# EAGLE design v3-tb (EAGLE 9.5.0)
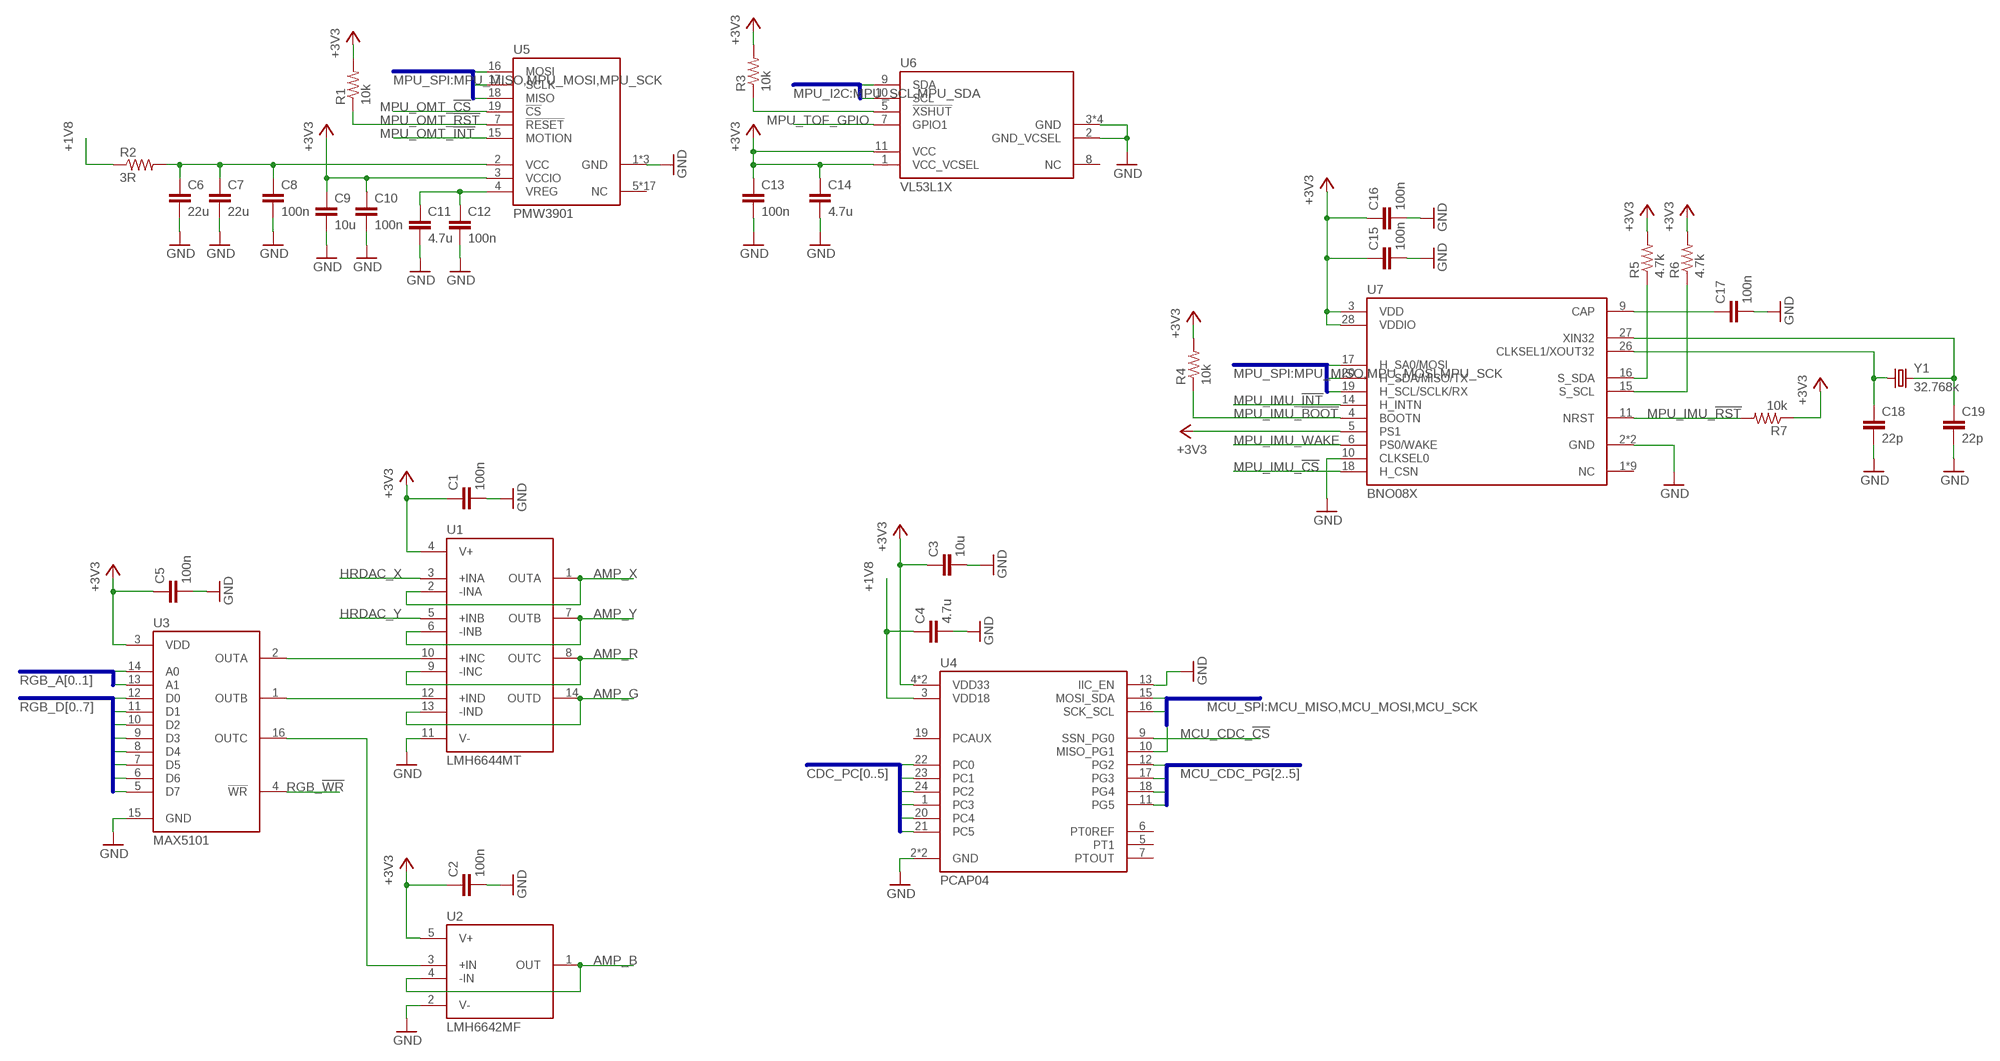
[diagram p0: schematic, sheet 1, part 1 of 2]
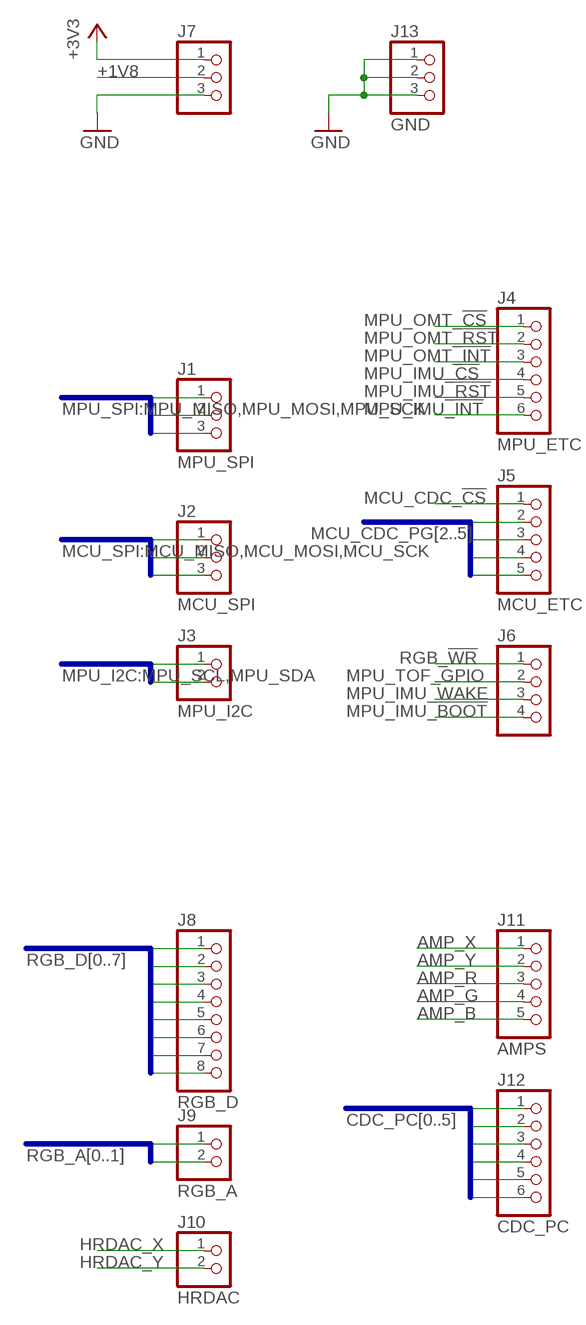
[diagram p1: schematic, sheet 1, part 2 of 2]

## Parts
C1  100n  C-EUC0603  [C0603]
C2  100n  C-EUC0603  [C0603]
C3  10u  C-EUC0603  [C0603]
C4  4.7u  C-EUC0603  [C0603]
C5  100n  C-EUC0603  [C0603]
C6  22u  C-EUC0603  [C0603]
C7  22u  C-EUC0603  [C0603]
C8  100n  C-EUC0603  [C0603]
C9  10u  C-EUC0603  [C0603]
C10  100n  C-EUC0603  [C0603]
C11  4.7u  C-EUC0603  [C0603]
C12  100n  C-EUC0603  [C0603]
C13  100n  C-EUC0603  [C0603]
C14  4.7u  C-EUC0603  [C0603]
C15  100n  C-EUC0603  [C0603]
C16  100n  C-EUC0603  [C0603]
C17  100n  C-EUC0603  [C0603]
C18  22p  C-EUC0603  [C0603]
C19  22p  C-EUC0603  [C0603]
J1  MPU_SPI  PINHD-1X3  [1X03]
J2  MCU_SPI  PINHD-1X3  [1X03]
J3  MPU_I2C  PINHD-1X2  [1X02]
J4  MPU_ETC  PINHD-1X6  [1X06]
J5  MCU_ETC  PINHD-1X5  [1X05]
J6  PINHD-1X4  [1X04]
J7  PINHD-1X3  [1X03]
J8  RGB_D  PINHD-1X8  [1X08]
J9  RGB_A  PINHD-1X2  [1X02]
J10  HRDAC  PINHD-1X2  [1X02]
J11  AMPS  PINHD-1X5  [1X05]
J12  CDC_PC  PINHD-1X6  [1X06]
J13  GND  PINHD-1X3  [1X03]
R1  10k  R-US_R0603  [R0603]
R2  3R  R-US_R0603  [R0603]
R3  10k  R-US_R0603  [R0603]
R4  10k  R-US_R0603  [R0603]
R5  4.7k  R-US_R0603  [R0603]
R6  4.7k  R-US_R0603  [R0603]
R7  10k  R-US_R0603  [R0603]
U1  LMH6644MT  [SOP65P640X120-14N]
U2  LMH6642MF  [SOT95P280X145-5N]
U3  MAX5101  [SOP65P640X110-16N]
U4  PCAP04  [QFN50P400X400X100-24N]
U5  PMW3901  [PMW3901]
U6  VL53L1X  [VL53L1X]
U7  BNO08X  [BNO08X]
Y1  32.768k  FC-12M  [FC-12M]

## Nets
+1V8 [power]: C4.1 J7.2 R2.1 U4.3(VDD18)
+3V3 [power]: C1.1 C2.1 C3.1 C5.1 C9.1 C10.1 C13.1 C14.1 C15.1 C16.1 J7.1 R1.2 R3.2 R4.2 R5.2 R6.2 R7.1 U1.4(V+) U2.5(V+) U3.3(VDD) U4.4(VDD33) U4.14(VDD33) U5.3(VCCIO) U6.1(VCC_VCSEL) U6.11(VCC) U7.3(VDD) U7.5(PS1) U7.28(VDDIO)
AMP_B: J11.5 U2.1(OUT) U2.4(-IN)
AMP_G: J11.4 U1.13(-IND) U1.14(OUTD)
AMP_R: J11.3 U1.8(OUTC) U1.9(-INC)
AMP_X: J11.1 U1.1(OUTA) U1.2(-INA)
AMP_Y: J11.2 U1.6(-INB) U1.7(OUTB)
CDC_PC0: J12.3 U4.22(PC0)
CDC_PC1: J12.4 U4.23(PC1)
CDC_PC2: J12.5 U4.24(PC2)
CDC_PC3: J12.6 U4.1(PC3)
CDC_PC4: J12.1 U4.20(PC4)
CDC_PC5: J12.2 U4.21(PC5)
GND [power]: C1.2 C2.2 C3.2 C4.2 C5.2 C6.2 C7.2 C8.2 C9.2 C10.2 C11.2 C12.2 C13.2 C14.2 C15.2 C16.2 C17.2 C18.2 C19.2 J7.3 J13.1 J13.2 J13.3 U1.11(V-) U2.2(V-) U3.15(GND) U4.2(GND) U4.8(GND) U4.13(IIC_EN) U5.1(GND) U5.21(GND) U5.29(GND) U6.2(GND_VCSEL) U6.3(GND) U6.4(GND) U6.6(GND) U6.12(GND) U7.2(GND) U7.10(CLKSEL0) U7.25(GND)
HRDAC_X: J10.1 U1.3(+INA)
HRDAC_Y: J10.2 U1.5(+INB)
MCU_CDC_!CS: J5.1 U4.9(SSN_PG0)
MCU_CDC_PG2: J5.2 U4.12(PG2)
MCU_CDC_PG3: J5.3 U4.17(PG3)
MCU_CDC_PG4: J5.4 U4.18(PG4)
MCU_CDC_PG5: J5.5 U4.11(PG5)
MCU_MISO: J2.2 U4.10(MISO_PG1)
MCU_MOSI: J2.1 U4.15(MOSI_SDA)
MCU_SCK: J2.3 U4.16(SCK_SCL)
MPU_IMU_!BOOT: J6.4 R4.1 U7.4(BOOTN)
MPU_IMU_!CS: J4.4 U7.18(H_CSN)
MPU_IMU_!INT: J4.6 U7.14(H_INTN)
MPU_IMU_!RST: J4.5 R7.2 U7.11(NRST)
MPU_IMU_WAKE: J6.3 U7.6(PS0/WAKE)
MPU_MISO: J1.2 U5.18(MISO) U7.20(H_SDA/MISO/TX)
MPU_MOSI: J1.1 U5.16(MOSI) U7.17(H_SA0/MOSI)
MPU_OMT_!CS: J4.1 U5.19(!CS)
MPU_OMT_!INT: J4.3 U5.15(MOTION)
MPU_OMT_!RST: J4.2 R1.1 U5.7(!RESET)
MPU_SCK: J1.3 U5.17(SCLK) U7.19(H_SCL/SCLK/RX)
MPU_SCL: J3.2 U6.10(SCL)
MPU_SDA: J3.1 U6.9(SDA)
MPU_TOF_GPIO: J6.2 U6.7(GPIO1)
N$1: C11.1 C12.1 U5.4(VREG)
N$2: R6.1 U7.15(S_SCL)
N$3: C6.1 C7.1 C8.1 R2.2 U5.2(VCC)
N$4: R3.1 U6.5(!XSHUT)
N$5: C19.1 U7.27(XIN32) Y1.2
N$6: U1.10(+INC) U3.2(OUTA)
N$7: U1.12(+IND) U3.1(OUTB)
N$8: U2.3(+IN) U3.16(OUTC)
N$9: R5.1 U7.16(S_SDA)
N$10: C17.1 U7.9(CAP)
N$11: C18.1 U7.26(CLKSEL1/XOUT32) Y1.1
RGB_!WR: J6.1 U3.4(!WR)
RGB_A0: J9.1 U3.14(A0)
RGB_A1: J9.2 U3.13(A1)
RGB_D0: J8.1 U3.12(D0)
RGB_D1: J8.2 U3.11(D1)
RGB_D2: J8.3 U3.10(D2)
RGB_D3: J8.4 U3.9(D3)
RGB_D4: J8.5 U3.8(D4)
RGB_D5: J8.6 U3.7(D5)
RGB_D6: J8.7 U3.6(D6)
RGB_D7: J8.8 U3.5(D7)
Unconnected: U4.5(PT1) U4.6(PT0REF) U4.7(PTOUT) U4.19(PCAUX) U5.5(NC) U5.6(NC) U5.8(NC) U5.9(NC) U5.10(NC) U5.11(NC) U5.12(NC) U5.13(NC) U5.14(NC) U5.20(NC) U5.22(NC) U5.23(NC) U5.24(NC) U5.25(NC) U5.26(NC) U5.27(NC) U5.28(NC) U6.8(NC) U7.1(NC) U7.7(NC) U7.8(NC) U7.12(NC) U7.13(NC) U7.21(NC) U7.22(NC) U7.23(NC) U7.24(NC)

## Buses
RGB_D[0..7]
RGB_A[0..1]
CDC_PC[0..5]
MCU_CDC_PG[2..5]
MCU_SPI:MCU_MISO,MCU_MOSI,MCU_SCK
MPU_SPI:MPU_MISO,MPU_MOSI,MPU_SCK
MPU_I2C:MPU_SCL,MPU_SDA

## Library data of the parts
C1-C19 = rcl:C-EU: CAPACITOR, European symbol; SPICEPREFIX: C
J1 J2 J7 J13 = pinhead:PINHD-1X3: PIN HEADER
J3 J9 J10 = pinhead:PINHD-1X2: PIN HEADER
J4 J12 = pinhead:PINHD-1X6: PIN HEADER
J5 J11 = pinhead:PINHD-1X5: PIN HEADER
J6 = pinhead:PINHD-1X4: PIN HEADER
J8 = pinhead:PINHD-1X8: PIN HEADER
R1-R7 = rcl:R-US_: RESISTOR, American symbol; SPICEPREFIX: R
U1 = v3-device-2:LMH6644
U2 = v3-device-2:LMH6642
U3 = v3-device-2:MAX5101
U4 = v3-device-2:PCAP04
U5 = v3-device-2:PMW3901
U6 = v3-device-2:VL53L1X
U7 = v3-device-2:BNO08X
Y1 = crystal:FC-12M: kHz RANGE CRYSTAL UNIT LOW PROFILE SMD Source: Epson Toyocom FC-12M.pdf

## Net classes
0 default: width 0.127 mm, drill 0.254 mm, clearance 0.127 mm
1 power: width 0.254 mm, drill 0.381 mm, clearance 0.127 mm

## Board
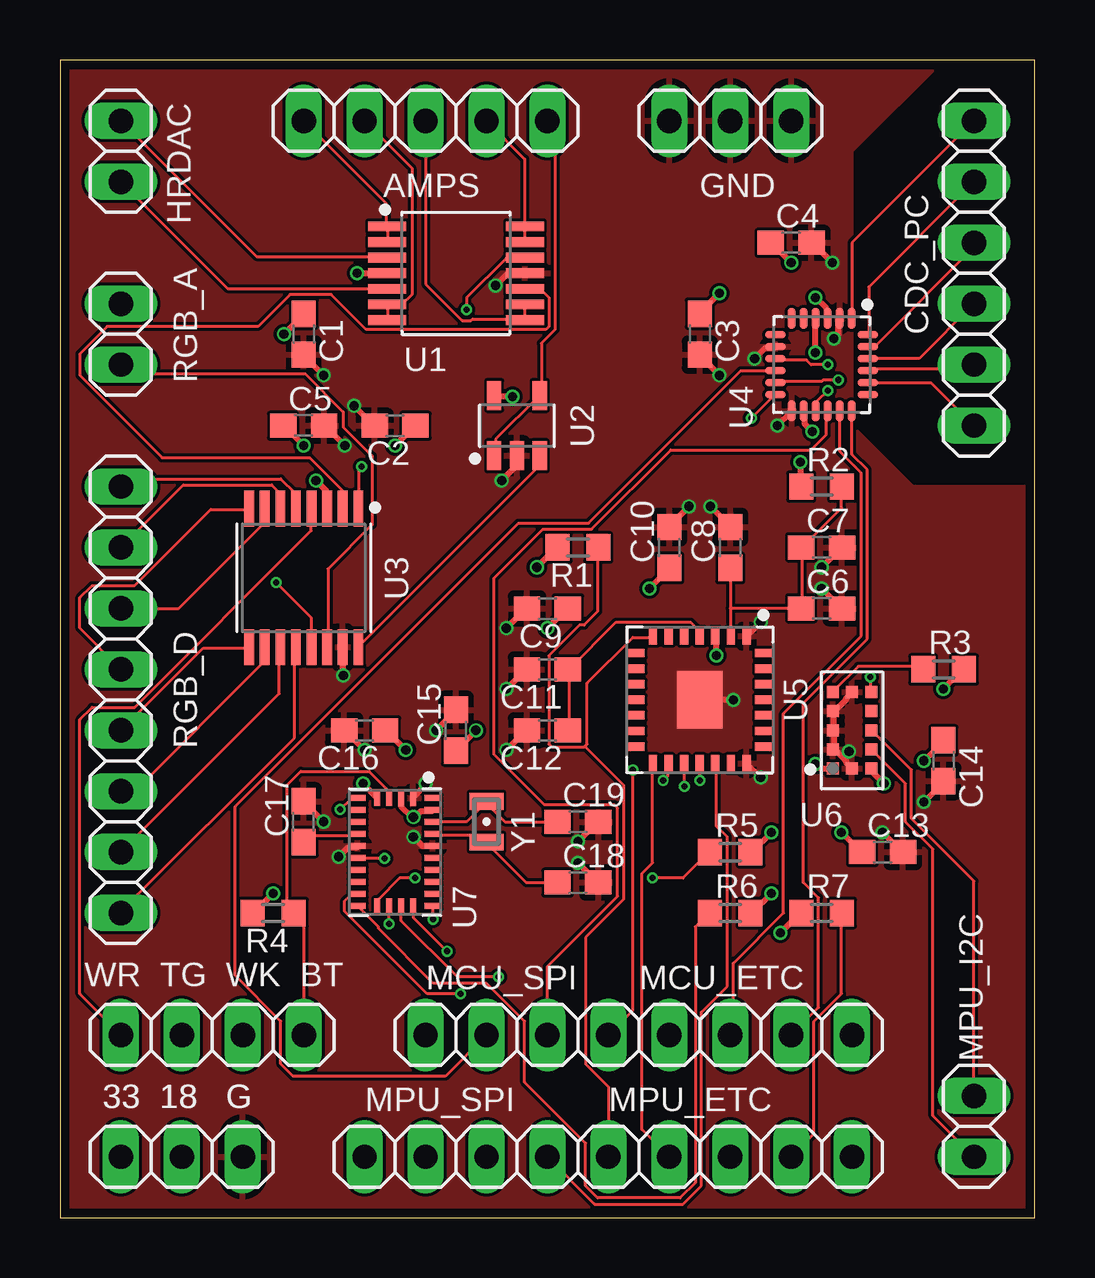
[diagram p2: board, top side]
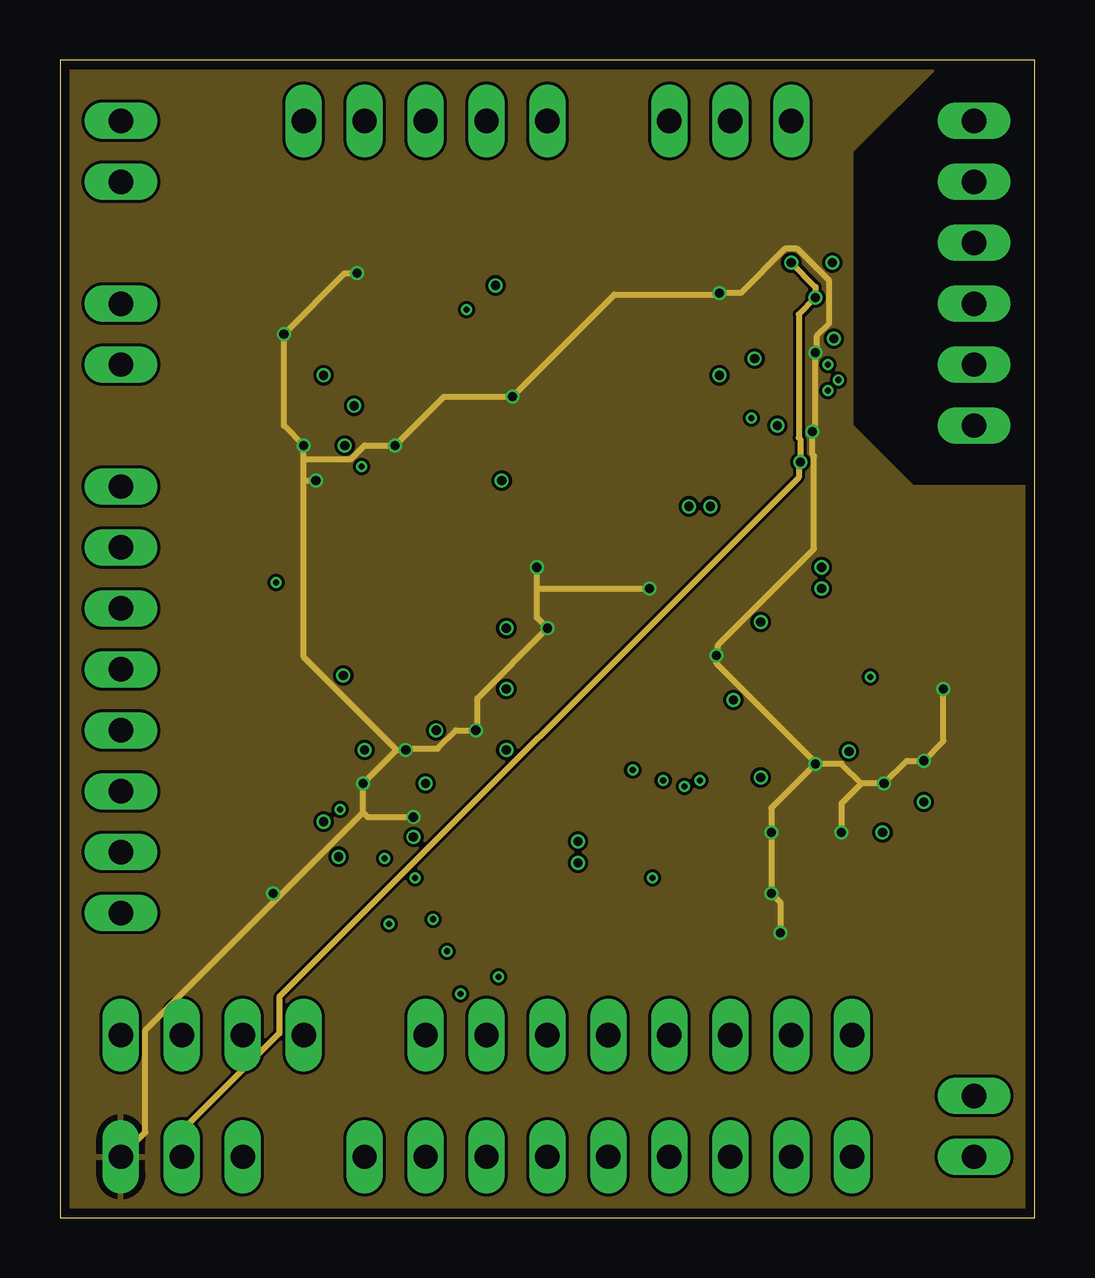
[diagram p3: board, inner layer Route2]
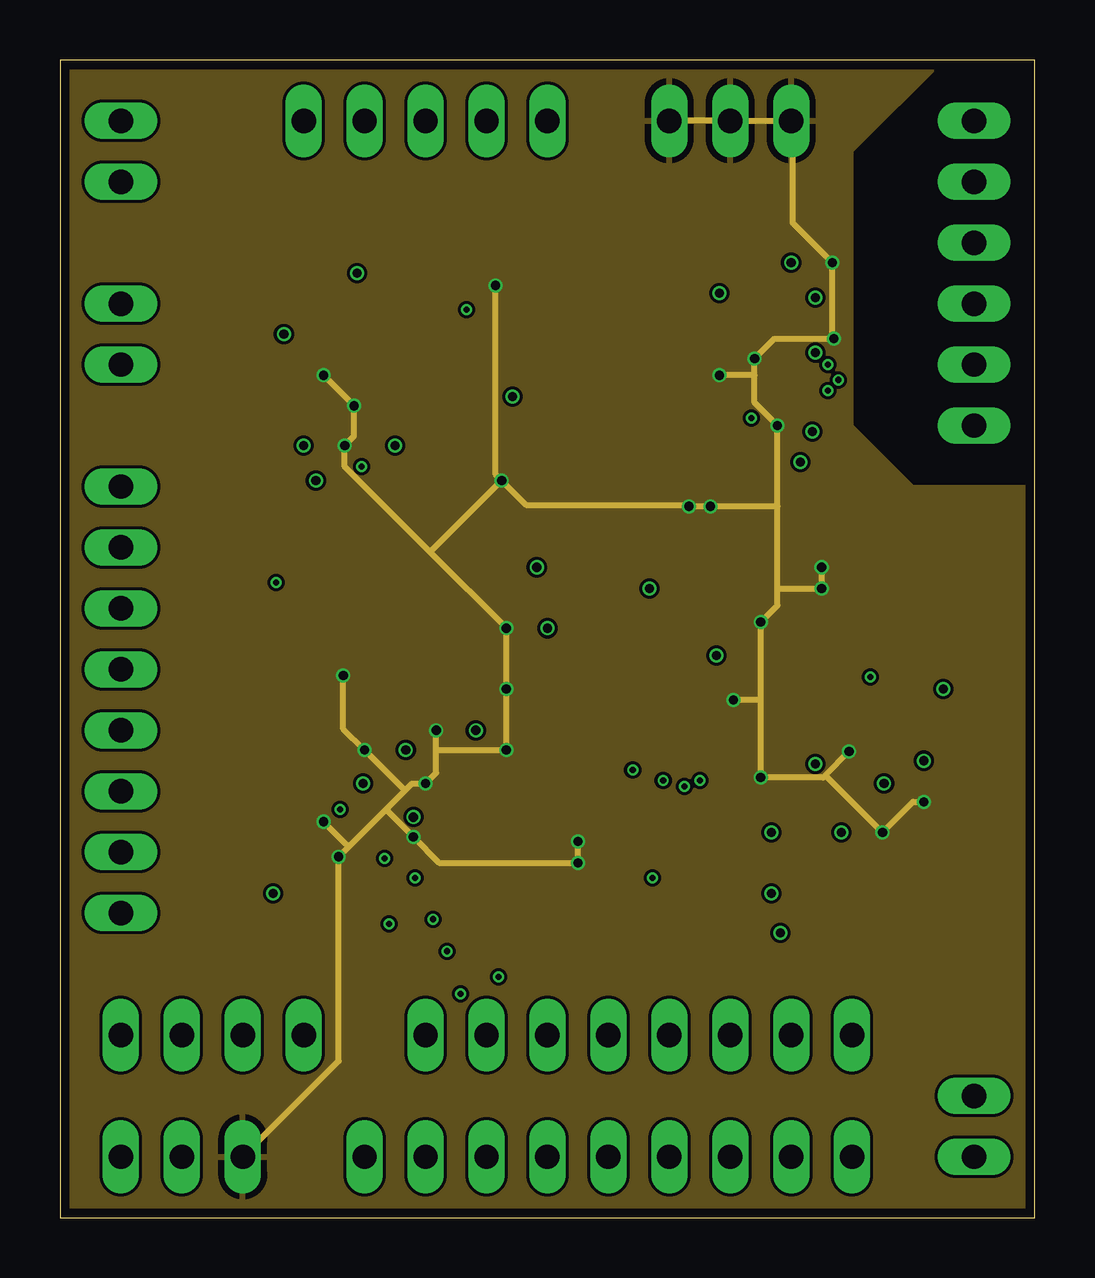
[diagram p4: board, inner layer Route15]
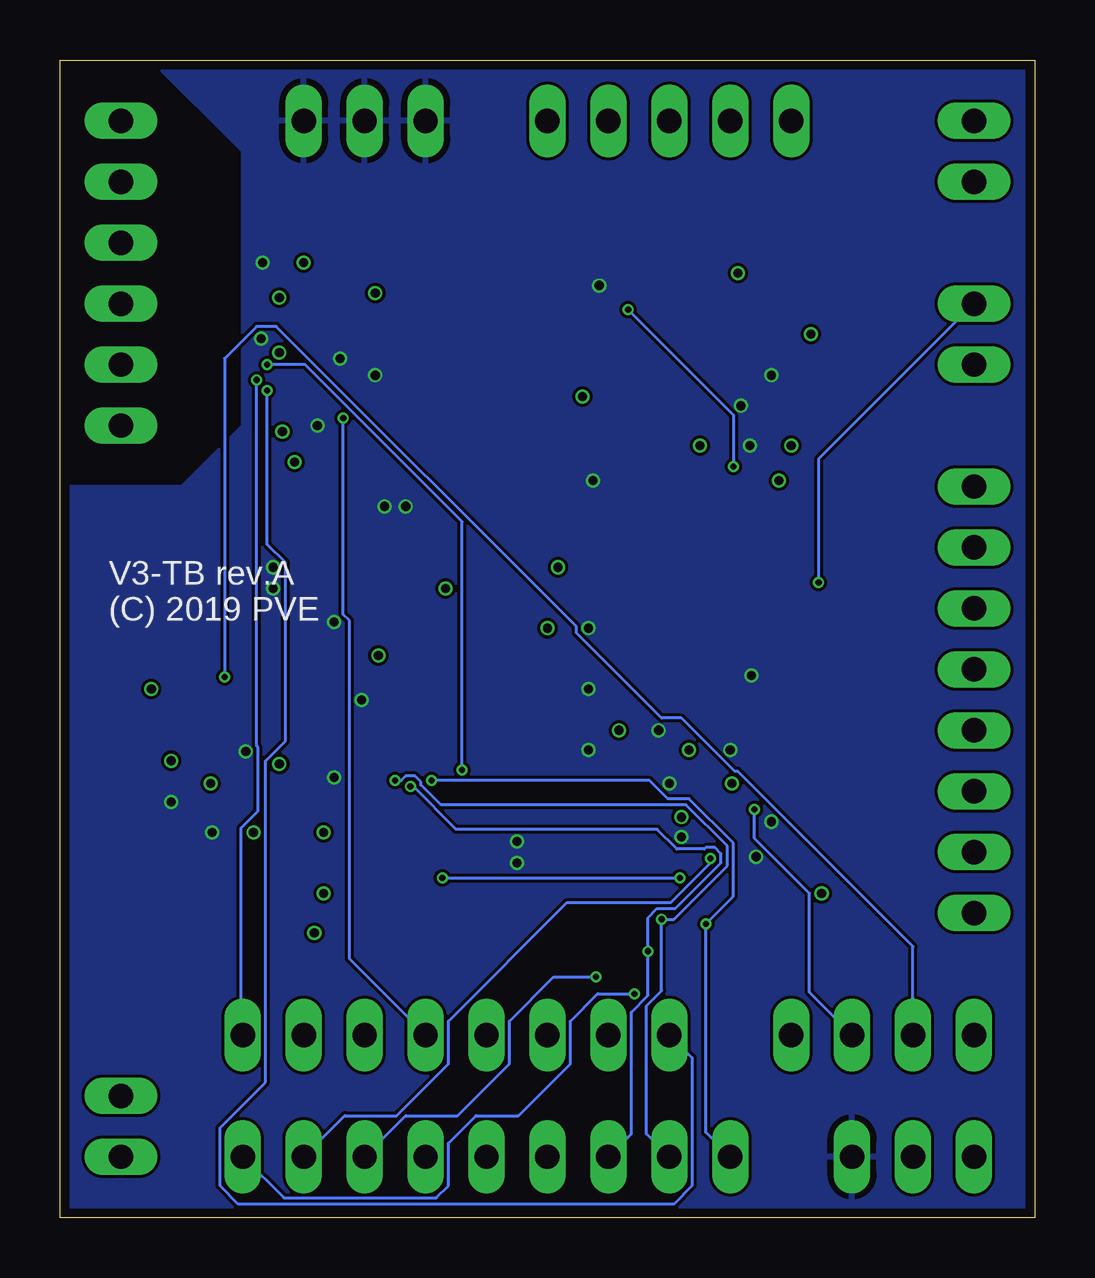
[diagram p5: board, bottom side, seen from below]

Size 40.64 x 48.26 mm. Coordinates in mm from the lower left corner, seen from the top.
Outline: 0,0 40.64,0 40.64,48.26 0,48.26 0,0
Copper layers (1+2*15+16): Top 0.035559375mm / dielectric 0.17018125mm / Route2 0.01778125mm / dielectric 47mil / Route15 0.01778125mm / dielectric 0.17018125mm / Bottom 0.035559375mm
Design rules "oshpark-4layer *": minimum track width 5mil, minimum drill 10mil, track to track 5mil, track to pad 5mil, pad to pad 5mil, via to via 5mil, smd to smd 5mil, copper to edge 15mil, drill to drill 6mil, minimum pad ring 4mil, minimum via ring 4mil, stop-mask expansion 2.5mil, vias tented up to drill 25mil, thermal gap 10mil

### Footprints (pad centres in the part's own frame; a part is rotated, then mirrored left to right if it is on the bottom)
C0603 = smd 1.1 x 1: 1 -0.85,0; 2 0.85,0
1X03 = drill 1.016 long: 1 -2.54,0; 2 0,0; 3 2.54,0
1X02 = drill 1.016 long: 1 -1.27,0; 2 1.27,0
1X06 = drill 1.016 long: 1 -6.35,0; 2 -3.81,0; 3 -1.27,0; 4 1.27,0; 5 3.81,0; 6 6.35,0
1X05 = drill 1.016 long: 1 -5.08,0; 2 -2.54,0; 3 0,0; 4 2.54,0; 5 5.08,0
1X04 = drill 1.016 long: 1 -3.81,0; 2 -1.27,0; 3 1.27,0; 4 3.81,0
1X08 = drill 1.016 long: 1 -8.89,0; 2 -6.35,0; 3 -3.81,0; 4 -1.27,0; 5 1.27,0; 6 3.81,0; 7 6.35,0; 8 8.89,0
R0603 = smd 1 x 1.1: 1 -0.85,0; 2 0.85,0
SOP65P640X120-14N = smd 1.572 x 0.407: 1 -2.872,1.95; 2 -2.872,1.3; 3 -2.872,0.65; 4 -2.872,0; 5 -2.872,-0.65; 6 -2.872,-1.3; 7 -2.872,-1.95; 8 2.872,-1.95; 9 2.872,-1.3; 10 2.872,-0.65; 11 2.872,0; 12 2.872,0.65; 13 2.872,1.3; 14 2.872,1.95
SOT95P280X145-5N = smd 1.209 x 0.589: 1 -1.253,0.95; 2 -1.253,0; 3 -1.253,-0.95; 4 1.253,-0.95; 5 1.253,0.95
SOP65P640X110-16N = smd 1.496 x 0.407: 1 -2.887,2.275; 2 -2.887,1.625; 3 -2.887,0.975; 4 -2.887,0.325; 5 -2.887,-0.325; 6 -2.887,-0.975; 7 -2.887,-1.625; 8 -2.887,-2.275; 9 2.887,-2.275; 10 2.887,-1.625; 11 2.887,-0.975; 12 2.887,-0.325; 13 2.887,0.325; 14 2.887,0.975; 15 2.887,1.625; 16 2.887,2.275
QFN50P400X400X100-24N = smd 0.861 x 0.303: 1 -1.926,1.25; 2 -1.926,0.75; 3 -1.926,0.25; 4 -1.926,-0.25; 5 -1.926,-0.75; 6 -1.926,-1.25; 13 1.926,-1.25; 14 1.926,-0.75; 15 1.926,-0.25; 16 1.926,0.25; 17 1.926,0.75; 18 1.926,1.25 | smd 0.303 x 0.861: 7 -1.25,-1.926; 8 -0.75,-1.926; 9 -0.25,-1.926; 10 0.25,-1.926; 11 0.75,-1.926; 12 1.25,-1.926; 19 1.25,1.926; 20 0.75,1.926; 21 0.25,1.926; 22 -0.25,1.926; 23 -0.75,1.926; 24 -1.25,1.926
PMW3901 = smd 0.7 x 0.35: 1 -2.65,1.95; 2 -2.65,1.3; 3 -2.65,0.65; 4 -2.65,0; 5 -2.65,-0.65; 6 -2.65,-1.3; 7 -2.65,-1.95; 15 2.65,-1.95; 16 2.65,-1.3; 17 2.65,-0.65; 18 2.65,0; 19 2.65,0.65; 20 2.65,1.3; 21 2.65,1.95 | smd 0.35 x 0.7: 8 -1.95,-2.65; 9 -1.3,-2.65; 10 -0.65,-2.65; 11 0,-2.65; 12 0.65,-2.65; 13 1.3,-2.65; 14 1.95,-2.65; 22 1.95,2.65; 23 1.3,2.65; 24 0.65,2.65; 25 0,2.65; 26 -0.65,2.65; 27 -1.3,2.65; 28 -1.95,2.65 | smd 2.4 x 1.9: 29 0,0
VL53L1X = smd 0.5 x 0.5: 1 0.8,1.6; 2 0.8,0.8; 3 0.8,0; 4 0.8,-0.8; 5 0.8,-1.6; 6 0,-1.6; 7 -0.8,-1.6; 8 -0.8,-0.8; 9 -0.8,0; 10 -0.8,0.8; 11 -0.8,1.6; 12 0,1.6
BNO08X = smd 0.25 x 0.675: 1 -2.25,1.558; 6 -2.25,-1.567; 7 -1.75,-1.567; 8 -1.25,-1.567; 9 -0.75,-1.567; 10 -0.25,-1.567; 11 0.25,-1.567; 12 0.75,-1.567; 13 1.25,-1.567; 14 1.75,-1.567; 15 2.25,-1.567; 20 2.25,1.558; 21 1.75,1.558; 22 1.25,1.558; 23 0.75,1.558; 24 0.25,1.558; 25 -0.25,1.558; 26 -0.75,1.558; 27 -1.25,1.558; 28 -1.75,1.558 | smd 0.675 x 0.25: 2 -2.268,0.75; 3 -2.268,0.25; 4 -2.268,-0.25; 5 -2.268,-0.75; 16 2.268,-0.75; 17 2.268,-0.25; 18 2.268,0.25; 19 2.268,0.75
FC-12M = smd 0.7 x 1.4: 1 -0.85,0; 2 0.85,0

### Placement (x,y rotation side)
C1  10.16,36.83 270 top
C2  13.97,33.02 180 top
C3  26.67,36.83 270 top
C4  30.48,40.64 0 top
C5  10.16,33.02 0 top
C6  31.75,25.4 0 top
C7  31.75,27.94 0 top
C8  27.94,27.94 90 top
C9  20.32,25.4 180 top
C10  25.4,27.94 90 top
C11  20.32,22.86 180 top
C12  20.32,20.32 180 top
C13  34.29,15.24 0 top
C14  36.83,19.05 270 top
C15  16.51,20.32 90 top
C16  12.7,20.32 180 top
C17  10.16,16.51 90 top
C18  21.59,13.97 0 top
C19  21.59,16.51 0 top
J1  15.24,2.54 0 top
J2  17.78,7.62 0 top
J3  38.1,3.81 270 top
J4  26.67,2.54 0 top
J5  27.94,7.62 0 top
J6  6.35,7.62 0 top
J7  5.08,2.54 0 top
J8  2.54,21.59 90 top
J9  2.54,36.83 90 top
J10  2.54,44.45 270 top
J11  15.24,45.72 0 top
J12  38.1,39.37 90 top
J13  27.94,45.72 0 top
R1  21.59,27.94 180 top
R2  31.75,30.48 0 top
R3  36.83,22.86 0 top
R4  8.89,12.7 180 top
R5  27.94,15.24 0 top
R6  27.94,12.7 0 top
R7  31.75,12.7 0 top
U1  16.51,39.37 0 top
U2  19.05,33.02 90 top
U3  10.16,26.67 270 top
U4  31.75,35.56 270 top
U5  26.67,21.59 270 top
U6  33.02,20.32 180 top
U7  13.97,15.24 270 top
Y1  17.78,16.51 90 top

### Tracks (layer width: path | path; a pad name or v marks a point on that pad's centre or on a via)
+1V8  (via drill 0.38)
  Top 0.254: v31.5,38.35 31.94,37.91 31.94,37.53 U4.3 | v30.48,39.81 29.65,40.64 C4.1 | v30.86,31.5 30.86,30.48 R2.1
  Route2 0.254: v30.48,39.81 31.5,38.8 v31.5,38.35 30.8,37.66 30.8,32.51 30.86,32.45 v30.86,31.5 30.8,31.43 30.8,30.86 9.14,9.21 9.14,7.68 5.08,3.62 J7.2
+3V3  (via drill 0.38)
  Top 0.254: v31.5,18.92 31.69,18.73 32.19,18.73 U6.1 | v34.35,18.1 33.78,18.67 U6.11 | v27.37,23.43 27.37,24.19 U5.3 | v31.37,32.77 31.05,33.08 31.05,33.59 U4.14 | v31.5,36.07 31.5,37.47 U4.4 | v29.65,13.53 28.83,12.7 R6.2 | v30.04,11.87 30.86,12.7 R7.1 | v29.65,16.07 28.83,15.24 R5.2 | v32.58,16.07 33.4,15.24 C13.1 | v36.01,19.05 36.83,19.88 C14.1 | v36.83,22.04 37.66,22.86 R3.2 | v27.5,38.54 26.67,37.72 C3.1 | v12.64,18.1 13.21,17.53 U7.5 | U7.3 14.22,17.46 14.22,17.14 14.67,16.7 v14.73,16.7 14.8,16.7 15.05,16.95 15.49,16.95 U7.28 | v8.89,13.53 8.06,12.7 R4.2 | v14.41,19.49 13.59,20.32 C16.1 | v17.34,20.32 16.51,19.49 C15.1 | v10.16,32.19 9.34,33.02 C5.1 | v20.32,24.57 21.14,25.4 C9.1 | v13.97,32.19 14.8,33.02 C2.1 | v9.34,36.83 10.16,37.66 C1.1 | v19.88,27.11 20.7,27.94 R1.2 | v24.57,26.23 25.4,27.05 C10.1 | v18.86,34.23 18.16,34.23 U2.5 | v10.67,30.73 11.11,30.29 11.11,29.59 U3.3 | v12.38,39.37 U1.4
  Route2 0.254: v31.5,18.92 32.58,18.92 33.4,18.1 | 33.4,18.1 v34.35,18.1 35.31,19.05 v36.01,19.05 36.83,19.88 v36.83,22.04 | v31.5,18.92 31.5,18.99 27.37,23.11 v27.37,23.43 27.43,23.5 27.43,23.88 31.43,27.88 31.43,31.75 31.37,31.81 v31.37,32.77 31.5,32.89 v31.5,36.07 31.56,36.13 31.56,36.77 32.07,37.27 32.07,39.05 30.73,40.39 30.23,40.39 28.38,38.54 v27.5,38.54 27.43,38.48 23.11,38.48 v18.86,34.23 16,34.23 v13.97,32.19 12.7,32.19 12.13,31.62 10.16,31.62 | v31.5,18.92 29.65,17.08 v29.65,16.07 v29.65,13.53 30.04,13.14 v30.04,11.87 | v32.58,16.07 32.58,17.27 33.4,18.1 | 12.64,16.89 v12.64,18.1 14.03,19.49 | 9.08,13.34 3.56,7.81 3.56,3.56 J7.1 | 9.08,13.34 12.64,16.89 | v14.73,16.7 12.83,16.7 12.64,16.89 | 9.08,13.34 v8.89,13.53 | 14.03,19.49 v14.41,19.49 14.48,19.56 15.75,19.56 16.51,20.32 v17.34,20.32 17.4,20.38 17.4,21.65 v20.32,24.57 19.88,25.02 19.88,26.23 | 10.16,30.73 10.16,23.37 14.03,19.49 | 10.16,30.73 10.16,31.62 | 10.16,31.62 v10.16,32.19 9.34,33.02 v9.34,36.83 11.87,39.37 v12.38,39.37 | 19.88,26.23 v19.88,27.11 | 19.88,26.23 v24.57,26.23 | 10.16,30.73 v10.67,30.73
  pour Route2: 0,48.26 0,0 40.64,0 40.64,30.48 35.56,30.48 33.02,33.02 33.02,44.45 36.83,48.26
AMP_B
  Top 0.127: U2.1 18.16,31.81 18.16,32.45 19.94,34.23 U2.4 20.07,34.29 20.07,36.45 20.64,37.02 20.64,45.4 J11.5
AMP_G
  Top 0.127: U1.13 19.37,40.7 19.37,41.27 U1.14 19.37,41.34 19.37,44.13 J11.4
AMP_R
  Top 0.127: U1.9 19.37,38.04 19.37,37.47 U1.8 19.3,37.47 17.21,37.47 17.14,37.4 16.76,37.4 15.24,38.92 J11.3
AMP_X
  Top 0.127: U1.2 13.65,40.7 13.65,41.27 U1.1 13.59,41.34 13.59,42.29 J11.1
AMP_Y
  Top 0.127: U1.7 13.65,37.47 13.65,38.04 U1.6 13.72,38.04 14.22,38.04 14.67,38.48 14.67,43.75 J11.2
CDC_PC0
  Top 0.127: J12.3 35.81,35.81 33.72,35.81 U4.22
CDC_PC1
  Top 0.127: J12.4 38.1,40.45 33.97,36.32 33.72,36.32 U4.23
CDC_PC2
  Top 0.127: J12.5 33.72,38.8 33.72,36.83 U4.24
CDC_PC3
  Top 0.127: J12.6 33.02,40.64 33.02,37.53 U4.1
CDC_PC4
  Top 0.127: J12.1 36.32,34.8 33.72,34.8 U4.20
CDC_PC5
  Top 0.127: J12.2 37.91,35.37 33.72,35.37 U4.21
GND  (via drill 0.38)
  Top 0.254: 32.64,19.18 32.32,19.49 U6.2 32.26,19.56 32.26,20.32 U6.3 32.26,20.38 32.26,21.08 U6.4 32.32,21.14 32.77,21.59 32.77,21.65 33.02,21.91 U6.6 | 32.64,19.18 32.77,19.05 32.77,18.99 33.02,18.73 U6.12 | v29.21,18.35 28.64,18.92 U5.21 | 32.64,19.18 v32.89,19.43 | v29.21,24.83 28.64,24.26 U5.1 | v29.91,33.02 30.48,33.59 U4.13 | v28.96,35.81 29.4,36.26 29.78,36.26 U4.8 | v32.26,36.64 32.45,36.83 32.45,37.47 U4.2 | v34.29,16.07 35.12,15.24 C13.2 | v36.01,17.34 36.83,18.16 C14.2 | v26.23,29.65 25.4,28.83 C10.2 | v27.11,29.65 27.94,28.83 C8.2 | v31.75,26.23 32.58,25.4 C6.2 | v31.75,27.11 32.58,27.94 C7.2 | v27.5,35.12 26.67,35.94 C3.2 | v32.19,39.81 31.37,40.64 C4.2 | v28.07,21.59 U5.29 | v11.62,15.05 12,15.43 12.38,15.43 U7.10 | v15.24,18.1 15.24,18.03 14.73,17.53 U7.2 | v14.73,15.88 15.11,15.49 15.49,15.49 U7.25 | v10.99,16.51 10.16,17.34 C17.2 | v12.7,19.49 11.87,20.32 C16.2 | v21.59,14.8 22.42,13.97 C18.2 | v21.59,15.68 22.42,16.51 C19.2 | v15.68,20.32 16.51,21.14 C15.2 | v18.61,19.49 19.43,20.32 C12.2 | v18.61,22.04 19.43,22.86 C11.2 | v18.61,24.57 19.43,25.4 C9.2 | v11.87,32.19 11.05,33.02 C5.2 | v12.26,33.85 13.08,33.02 C2.2 | v10.99,35.12 10.16,35.94 C1.2 | U2.2 19.05,31.37 v18.41,30.73 | v11.81,22.61 11.81,23.75 U3.15 | U1.11 18.67,39.37 v18.16,38.86
  Route15 0.254: J13.1 J13.2 J13.3 30.54,45.66 30.54,41.47 v32.19,39.81 32.19,36.7 v32.26,36.64 29.78,36.64 v28.96,35.81 28.96,35.12 | v32.89,19.43 31.91,18.45 | 31.91,18.45 31.81,18.35 v29.21,18.35 29.21,21.59 | 29.21,21.59 v29.21,24.83 29.91,25.53 29.91,26.23 | 29.91,26.23 29.91,29.65 | 29.91,29.65 v29.91,33.02 28.96,33.97 28.96,35.12 | 31.91,18.45 v34.29,16.07 35.56,17.34 v36.01,17.34 | 29.91,29.65 v27.11,29.65 v26.23,29.65 26.16,29.72 19.43,29.72 v18.41,30.73 | 29.91,26.23 v31.75,26.23 v31.75,27.11 | 28.96,35.12 v27.5,35.12 | 29.21,21.59 v28.07,21.59 | J7.3 11.62,6.54 v11.62,15.05 12.03,15.46 | 12.03,15.46 13.59,17.02 | 13.59,17.02 14.38,17.81 | 14.38,17.81 14.67,18.1 v15.24,18.1 15.68,18.54 15.68,19.49 | 13.59,17.02 v14.73,15.88 15.81,14.8 v21.59,14.8 v21.59,15.68 | 12.03,15.46 v10.99,16.51 | 14.38,17.81 v12.7,19.49 11.81,20.38 v11.81,22.61 | 15.68,19.49 v15.68,20.32 | 15.68,19.49 v18.61,19.49 v18.61,22.04 v18.61,24.57 15.43,27.75 | 15.43,27.75 11.87,31.3 v11.87,32.19 12.26,32.58 v12.26,33.85 v10.99,35.12 | 15.43,27.75 v18.41,30.73 | v18.16,38.86 18.16,30.99 v18.41,30.73
  pour Top: 0,0 40.64,0 40.64,30.48 35.56,30.48 33.02,33.02 33.02,44.45 36.83,48.26 0,48.26
  pour Route15: 0,48.26 0,0 40.64,0 40.64,30.48 35.56,30.48 33.02,33.02 33.02,44.45 36.83,48.26
  pour Bottom: 0,0 40.64,0 40.64,30.48 35.56,30.48 33.02,33.02 33.02,44.45 36.83,48.26 0,48.26
HRDAC_X
  Top 0.127: J10.1 8.19,40.07 13.59,40.07 U1.3
HRDAC_Y
  Top 0.127: J10.2 6.99,38.73 13.59,38.73 U1.5
MCU_CDC_!CS  (via drill 0.25)
  Top 0.127: v32,35.56 31.3,35.56 31.11,35.75 29.84,35.75 U4.9 | v23.88,18.67 23.88,8.64 J5.1
  Bottom 0.127: v32,35.56 30.42,35.56 23.88,29.02 v23.88,18.67
MCU_CDC_PG2  (via drill 0.25)
  Top 0.127: v28.83,33.34 29.78,34.29 U4.12
  Bottom 0.127: v28.83,33.34 28.83,25.15 28.57,24.89 28.57,10.79 J5.2
MCU_CDC_PG3
  Top 0.127: J5.3 28.07,7.75 28.07,10.6 30.16,12.7 30.16,21.02 33.4,24.26 33.4,31.05 32.51,31.94 32.51,33.59 U4.17
MCU_CDC_PG4
  Top 0.127: J5.4 31.62,8.76 31.62,13.34 30.99,13.97 30.99,21.46 33.66,24.13 33.66,31.18 33.02,31.81 33.02,33.59 U4.18
MCU_CDC_PG5  (via drill 0.25)
  Top 0.127: v32.45,34.92 31.81,34.92 31.75,34.86 29.84,34.86 U4.11
  Bottom 0.127: v32.45,34.92 32.45,19.68 32.38,19.62 32.38,16.95 33.08,16.26 33.08,7.68 J5.5
MCU_MISO
  Top 0.127: J2.2 16.07,5.91 9.72,5.91 9.21,6.41 9.21,8.19 7.3,10.1 7.3,17.14 19.11,28.96 22.04,28.96 28.38,35.31 29.78,35.31 U4.10
MCU_MOSI  (via drill 0.25)
  Top 0.127: v32,34.48 31.56,34.04 31.56,33.66 U4.15
  Bottom 0.127: v32,34.48 32,28.07 31.24,27.3 31.24,19.88 32.07,19.05 32.07,5.65 33.97,3.75 33.97,1.33 33.21,0.57 15.05,0.57 14.29,1.33 14.29,6.67 J2.1
MCU_SCK
  Top 0.127: J2.3 20.32,10.48 23.24,13.4 23.24,17.08 23.11,17.21 20.19,17.21 18.1,19.3 18.1,26.67 20.13,28.7 22.16,28.7 25.46,32 31.3,32 31.94,32.64 31.94,33.59 U4.16
MPU_IMU_!BOOT
  Top 0.127: U7.4 13.72,17.53 13.72,17.78 12.89,18.61 10.03,18.61 9.46,18.03 9.46,12.95 9.72,12.7 R4.1 9.78,12.7 10.16,12.32 J6.4
MPU_IMU_!CS  (via drill 0.25)
  Top 0.127: v18.29,10.03 16.57,10.03 14.22,12.38 14.22,12.95 U7.18
  Bottom 0.127: v18.29,10.03 20.07,10.03 21.91,8.19 21.91,6.41 24.07,4.25 26.23,4.25 J4.4
MPU_IMU_!INT  (via drill 0.25)
  Top 0.127: v16.7,9.34 15.3,9.34 11.87,12.76 11.87,13.21 12.13,13.46 12.38,13.46 U7.14
  Bottom 0.127: v16.7,9.34 18.22,9.34 19.37,8.19 19.37,6.41 21.53,4.25 23.3,4.25 24.45,3.11 24.45,1.33 24.96,0.83 31.3,0.83 J4.6
MPU_IMU_!RST  (via drill 0.25)
  Top 0.127: v13.53,14.99 12.45,14.99 U7.11 | J4.5 31.43,3.49 31.43,8.19 32.58,9.34 32.58,12.7 R7.2
  Bottom 0.127: v13.53,14.99 13.53,14.8 15.18,13.14 19.49,13.14 24.45,8.19 24.45,6.41 26.61,4.25 28.77,4.25 J4.5
MPU_IMU_WAKE  (via drill 0.25)
  Top 0.127: v11.68,17.02 12.13,17.46 12.38,17.46 U7.6
  Bottom 0.127: v11.68,17.02 11.68,15.81 9.4,13.53 9.4,9.4 J6.3
MPU_MISO  (via drill 0.25)
  Top 0.127: v15.56,12.45 15.56,12.95 U7.20 | v26.67,18.22 U5.18
  Bottom 0.127: J1.2 16.19,3.49 16.19,8.83 15.56,9.46 v15.56,12.45 15.05,12.45 12.83,14.67 12.83,15.49 14.54,17.21 24.77,17.21 25.59,18.03 25.59,18.16 25.84,18.41 26.23,18.41 26.42,18.22 v26.67,18.22
MPU_MOSI  (via drill 0.25)
  Top 0.127: v13.72,12.26 13.72,12.95 U7.17 | v25.15,18.22 25.34,18.41 25.34,18.92 U5.16
  Bottom 0.127: J1.1 13.72,3.56 v13.72,12.26 12.57,13.4 12.57,15.62 14.41,17.46 15.3,17.46 16.07,18.22 v25.15,18.22
MPU_OMT_!CS
  Top 0.127: J4.1 22.29,0.57 25.97,0.57 26.73,1.33 26.73,8.57 27.81,9.65 27.81,15.88 27.37,16.32 27.37,18.92 U5.19
MPU_OMT_!INT
  Top 0.127: J4.3 24.26,3.68 24.26,14.35 24.7,14.8 24.7,18.92 U5.15
MPU_OMT_!RST
  Top 0.127: 21.88,19.65 21.84,19.62 20.51,19.62 20.38,19.75 20.38,23.43 21.65,24.7 21.84,24.7 22.42,25.27 22.42,27.94 R1.1 | 21.88,19.65 21.97,19.75 21.97,22.29 23.88,24.19 24.7,24.19 U5.7 | J4.2 22.86,5.46 21.91,6.41 21.91,11.68 23.5,13.27 23.5,18.03 21.88,19.65
MPU_SCK  (via drill 0.25)
  Top 0.127: v16.13,11.11 14.73,12.51 14.73,12.95 U7.19 | v26.04,17.97 26.04,18.92 U5.17
  Bottom 0.127: J1.3 16.83,3.49 16.83,8.57 16.13,9.27 v16.13,11.11 16.13,12.51 15.75,12.89 14.99,12.89 13.08,14.8 13.08,15.18 13.34,15.43 13.72,15.43 13.78,15.37 14.92,15.37 15.75,16.19 24.13,16.19 25.91,17.97 v26.04,17.97
MPU_SCL
  Top 0.127: U6.10 35.24,18.1 35.24,16.51 36.39,15.37 36.39,4.25 J3.2
MPU_SDA
  Top 0.127: J3.1 38.1,14.03 35.5,16.64 35.5,18.67 33.85,20.32 U6.9
MPU_TOF_GPIO  (via drill 0.25)
  Top 0.127: v33.78,22.54 33.78,21.97 U6.7
  Bottom 0.127: v33.78,22.54 33.78,35.81 32.45,37.15 31.62,37.15 19.11,24.64 19.11,24.38 15.56,20.83 14.73,20.83 12.51,18.61 12.38,18.61 5.08,11.3 J6.2
N$1
  Top 0.127: U5.4 26.67,24.45 26.29,24.83 23.18,24.83 21.21,22.86 | 21.21,22.86 21.21,20.32 C12.1 | 21.21,22.86 C11.1
N$2
  Top 0.127: U7.15 12.45,12.95 13.27,12.13 13.27,12.06 15.56,9.78 17.78,9.78 19.37,8.19 19.37,5.65 21.91,3.11 21.91,1.33 22.42,0.83 25.84,0.83 26.48,1.46 26.48,12.13 27.05,12.7 R6.1
N$3
  Top 0.127: C8.1 27.94,25.4 | 27.94,25.4 27.94,24.26 U5.2 | 30.92,27.94 30.92,25.4 C6.1 27.94,25.4 | 30.92,27.94 32.58,29.59 32.58,30.48 R2.2 | 30.92,27.94 C7.1
N$4
  Top 0.127: U6.5 32.26,21.97 33.27,22.99 35.81,22.99 35.94,22.86 R3.1
N$5
  Top 0.127: U7.27 15.56,16.51 16.95,16.51 17.78,17.34 Y1.2 17.78,17.27 18.54,16.51 C19.1
N$6
  Top 0.127: U3.2 11.75,29.59 11.75,30.35 10.41,31.69 4.25,31.69 0.83,35.12 0.83,36.01 1.97,37.15 8.26,37.15 9.59,38.48 11.3,38.48 12.76,37.02 20.26,37.02 20.38,37.15 20.38,38.35 20.07,38.67 19.43,38.67 U1.10
N$7  (via drill 0.25)
  Top 0.127: v12.57,31.3 12.45,31.18 12.45,29.59 U3.1 | v16.95,37.85 16.95,38.35 18.61,40.01 19.37,40.01 U1.12
  Bottom 0.127: v12.57,31.3 12.57,33.47 v16.95,37.85
N$8
  Top 0.127: U2.3 19.94,31.75 19.94,31.3 12.45,23.81 U3.16
N$9  (via drill 0.25)
  Top 0.127: v14.8,14.16 14.16,14.16 13.27,13.27 13.27,13.02 U7.16 | v24.7,14.16 25.97,14.16 27.05,15.24 R5.1
  Bottom 0.127: v24.7,14.16 v14.8,14.16
N$10
  Top 0.127: U7.9 12.38,15.94 10.41,15.94 10.16,15.68 C17.1
N$11
  Top 0.127: U7.26 15.56,15.94 17.53,15.94 17.78,15.68 Y1.1 17.78,15.62 19.43,13.97 C18.1
RGB_!WR
  Top 0.127: J6.1 0.83,9.34 0.83,20.77 1.33,21.27 3.11,21.27 10.48,28.64 10.48,29.53 U3.4
RGB_A0
  Top 0.127: J9.1 2.92,35.18 10.22,35.18 11.81,33.59 11.81,32.96 13.02,31.75 13.02,28.89 11.18,27.05 11.18,23.81 U3.14
RGB_A1  (via drill 0.25)
  Top 0.127: v9.02,26.48 10.48,25.02 10.48,23.81 U3.13
  Bottom 0.127: v9.02,26.48 9.02,31.62 J9.2
RGB_D0
  Top 0.127: J8.1 2.54,12.76 9.78,20 9.78,23.75 U3.12
RGB_D1
  Top 0.127: J8.2 9.14,21.84 9.14,23.75 U3.11
RGB_D2
  Top 0.127: J8.3 3.11,17.78 8.51,23.18 8.51,23.75 U3.10
RGB_D3
  Top 0.127: J8.4 5.97,23.75 7.87,23.75 U3.9
RGB_D4
  Top 0.127: J8.5 0.83,24.57 0.83,25.84 1.33,26.35 3.11,26.35 6.29,29.53 7.87,29.53 U3.8
RGB_D5
  Top 0.127: J8.6 4.95,25.4 8.51,28.96 8.51,29.53 U3.7
RGB_D6
  Top 0.127: J8.7 5.14,30.54 8.83,30.54 9.14,30.23 9.14,29.59 U3.6
RGB_D7
  Top 0.127: J8.8 2.86,30.8 9.21,30.8 9.78,30.23 9.78,29.59 U3.5

### Text on the board
tNames: WR TG WK BT | 33 18 G | 33 18 G
bNames: V3-TB rev.A / (C) 2019 PVE